# Altium schematic sheet MultiChannelLdc4.SchDoc
size A4
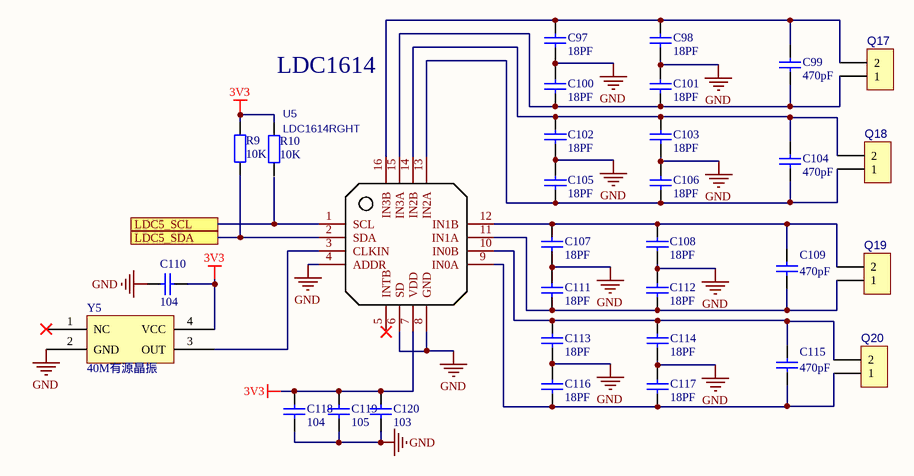
[diagram p0: MultiChannelLdc4.SchDoc]

## Parts
C97  18PF  [C0603_L]
C98  18PF  [C0603_L]
C99  470pF  [C0603_L]
C100  18PF  [C0603_L]
C101  18PF  [C0603_L]
C102  18PF  [C0603_L]
C103  18PF  [C0603_L]
C104  470pF  [C0603_L]
C105  18PF  [C0603_L]
C106  18PF  [C0603_L]
C107  18PF  [C0603_L]
C108  18PF  [C0603_L]
C109  470pF  [C0603_L]
C110  104  [C0603_L]
C111  18PF  [C0603_L]
C112  18PF  [C0603_L]
C113  18PF  [C0603_L]
C114  18PF  [C0603_L]
C115  470pF  [C0603_L]
C116  18PF  [C0603_L]
C117  18PF  [C0603_L]
C118  104  [C0603_L]
C119  105  [C0603_L]
C120  103  [C0603_L]
Q17  (no value)  [座子]
Q18  (no value)  [座子]
Q19  (no value)  [座子]
Q20  (no value)  [座子]
R9  value 10K  [R0603_L]  (hidden comment: Res2)
R10  value 10K  [R0603_L]  (hidden comment: Res2)
U5  LDC1614RGHT  [W-QFN-16]
Y5  40M有源晶振  [SMD3225]

## Ports
LDC5_SCL, LDC5_SDA

## Nets
3V3: C110.1 C118.1 C119.1 C120.1 R9.2 R10.1 U5.7(VDD) Y5.4(VCC)
GND: C97.2 C98.2 C100.1 C101.1 C102.2 C103.2 C105.1 C106.1 C107.2 C108.2 C110.2 C111.1 C112.1 C113.2 C114.2 C116.1 C117.1 C118.2 C119.2 C120.2 U5.4(ADDR) U5.6(SD) U5.8(GND) Y5.2(GND)
LDC5_SCL: U5.1(SCL) ; port LDC5_SCL
LDC5_SDA: R9.1 U5.2(SDA) ; port LDC5_SDA
NetC97_1: C97.1 C98.1 C99.2 Q17.2 U5.16(IN3B)
NetC99_1: C99.1 C100.2 C101.2 Q17.1 U5.15(IN3A)
NetC102_1: C102.1 C103.1 C104.2 Q18.2 U5.14(IN2B)
NetC104_1: C104.1 C105.2 C106.2 Q18.1 U5.13(IN2A)
NetC107_1: C107.1 C108.1 C109.2 Q19.2 U5.12(IN1B)
NetC109_1: C109.1 C111.2 C112.2 Q19.1 U5.11(IN1A)
NetC113_1: C113.1 C114.1 C115.2 Q20.2 U5.10(IN0B)
NetC115_1: C115.1 C116.2 C117.2 Q20.1 U5.9(IN0A)
NetU5_3: U5.3(CLKIN) Y5.3(OUT)

Not connected (* = marked no-connect by the designer): R10 2; U5 5(INTB)*; Y5 1(NC)*

## Notes on the sheet
- LDC1614

## Library data of the parts
C97-C109 C111-C117 C119 C120 = Cap: Capacitor; Value: 104; Published: 8-Jun-2000; LatestRevisionDate: 17-Jul-2002; LatestRevisionNote: Re-released for DXP Platform.; Publisher: Altium Limited
C110 = C: 贴片电容/MLCC电容; BOM名称: 无极性贴片电容; 联系下单店铺卖家 免费帮你查找封装: 联系下单店铺卖家 免费技术支持
C118 = Cap: Capacitor; Published: 8-Jun-2000; LatestRevisionDate: 17-Jul-2002; LatestRevisionNote: Re-released for DXP Platform.; Publisher: Altium Limited; Value: 104
Q17-Q20 = CON2: Connector
R9 R10 = Res2: Resistor; Published: 8-Jun-2000; LatestRevisionDate: 17-Jul-2002; LatestRevisionNote: Re-released for DXP Platform.; PackageReference: AXIAL-0.4; Publisher: Altium Limited; PackageDescription: Axial Device, Thru-Hole; 2 Leads; 0.4 in Pin Spacing
U5 = LDC1614RGHT: BOM_Manufacturer: TI; BOM_Manufacturer Part: LDC1314RGHT; SMT Type: Extend; BOM_Supplier: LCSC; image: //image.lceda.cn/szlcsc/C80399.jpg; BOM_Supplier Part: C80399; BOM_LCSC Assembly: Yes; spicePre: U; spiceSymbolName: LDC1314RGHT
Y5 = 有源晶振